# Altium schematic sheet Bin_R_Box.SchDoc
size A
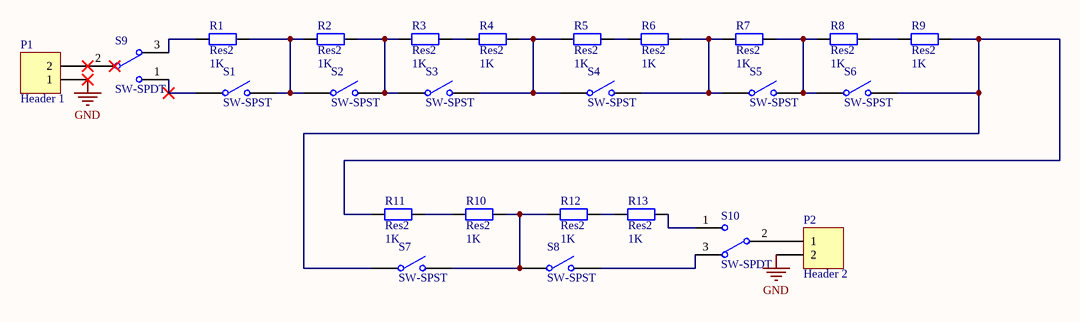
[diagram p0: Bin_R_Box.SchDoc]

## Parts
P1  Header 1  [HDR1X2]
P2  Header 2  [HDR1X2]
R1  Res2  value 1K  [Resist]
R2  Res2  value 1K  [Resist]
R3  Res2  value 1K  [Resist]
R4  Res2  value 1K  [Resist]
R5  Res2  value 1K  [Resist]
R6  Res2  value 1K  [Resist]
R7  Res2  value 1K  [Resist]
R8  Res2  value 1K  [Resist]
R9  Res2  value 1K  [Resist]
R10  Res2  value 1K  [Resist]
R11  Res2  value 1K  [Resist]
R12  Res2  value 1K  [Resist]
R13  Res2  value 1K  [Resist]
S1  SW-SPST  [SPST]
S2  SW-SPST  [SPST]
S3  SW-SPST  [SPST]
S4  SW-SPST  [SPST]
S5  SW-SPST  [SPST]
S6  SW-SPST  [SPST]
S7  SW-SPST  [SPST]
S8  SW-SPST  [SPST]
S9  SW-SPDT  [SPDT]
S10  SW-SPDT  [SPDT]

## Nets
GND: P1.1 P2.2
NetP1_2: P1.2 S9.2
NetP2_1: P2.1 S10.2
NetR1_1: R1.1 S9.3
NetR1_2: R1.2 R2.1 S1.2(NO) S2.1(COMMON)
NetR2_2: R2.2 R3.1 S2.2(NO) S3.1(COMMON)
NetR3_2: R3.2 R4.1
NetR4_2: R4.2 R5.1 S3.2(NO) S4.1(COMMON)
NetR5_2: R5.2 R6.1
NetR6_2: R6.2 R7.1 S4.2(NO) S5.1(COMMON)
NetR7_2: R7.2 R8.1 S5.2(NO) S6.1(COMMON)
NetR8_2: R8.2 R9.1
NetR9_2: R9.2 R11.1 S6.2(NO) S7.1(COMMON)
NetR10_1: R10.1 R11.2
NetR10_2: R10.2 R12.1 S7.2(NO) S8.1(COMMON)
NetR12_2: R12.2 R13.1
NetR13_2: R13.2 S10.1
NetS1_1: S1.1(COMMON) S9.1
NetS8_2: S8.2(NO) S10.3

## Library data of the parts
P1 P2 = Header 2: Header, 2-Pin; LatestRevisionDate: 17-Jul-2002; LatestRevisionNote: Re-released for DXP Platform.; Publisher: Altium Limited
R1-R13 = Res2: Resistor; Published: 8-Jun-2000; LatestRevisionDate: 17-Jul-2002; LatestRevisionNote: Re-released for DXP Platform.; PackageReference: AXIAL-0.4; Publisher: Altium Limited
S1-S8 = SW-SPST: Single-Pole, Single-Throw Switch; Published: 24-Mar-1999; LatestRevisionDate: 17-Jul-2002; LatestRevisionNote: Re-released for DXP Platform.; PackageReference: SPST-2; Publisher: Altium Limited
S9 S10 = SW-SPDT: SPDT Subminiature Toggle Switch, Right Angle Mounting, Vertical Actuation; Published: 24-Mar-1999; LatestRevisionDate: 17-Dec-2003; LatestRevisionNote: Schematic revised, PCB Footprint replaced.; DatasheetVersion: 05-Dec-2000; PackageReference: TL36WW15050; Publisher: Altium Limited; ComponentLink1Description: Manufacturer Link; ComponentLink1URL: http://www.apem.com